# EAGLE design emonDCduo-ESP v3.6 (EAGLE 9.3.0)
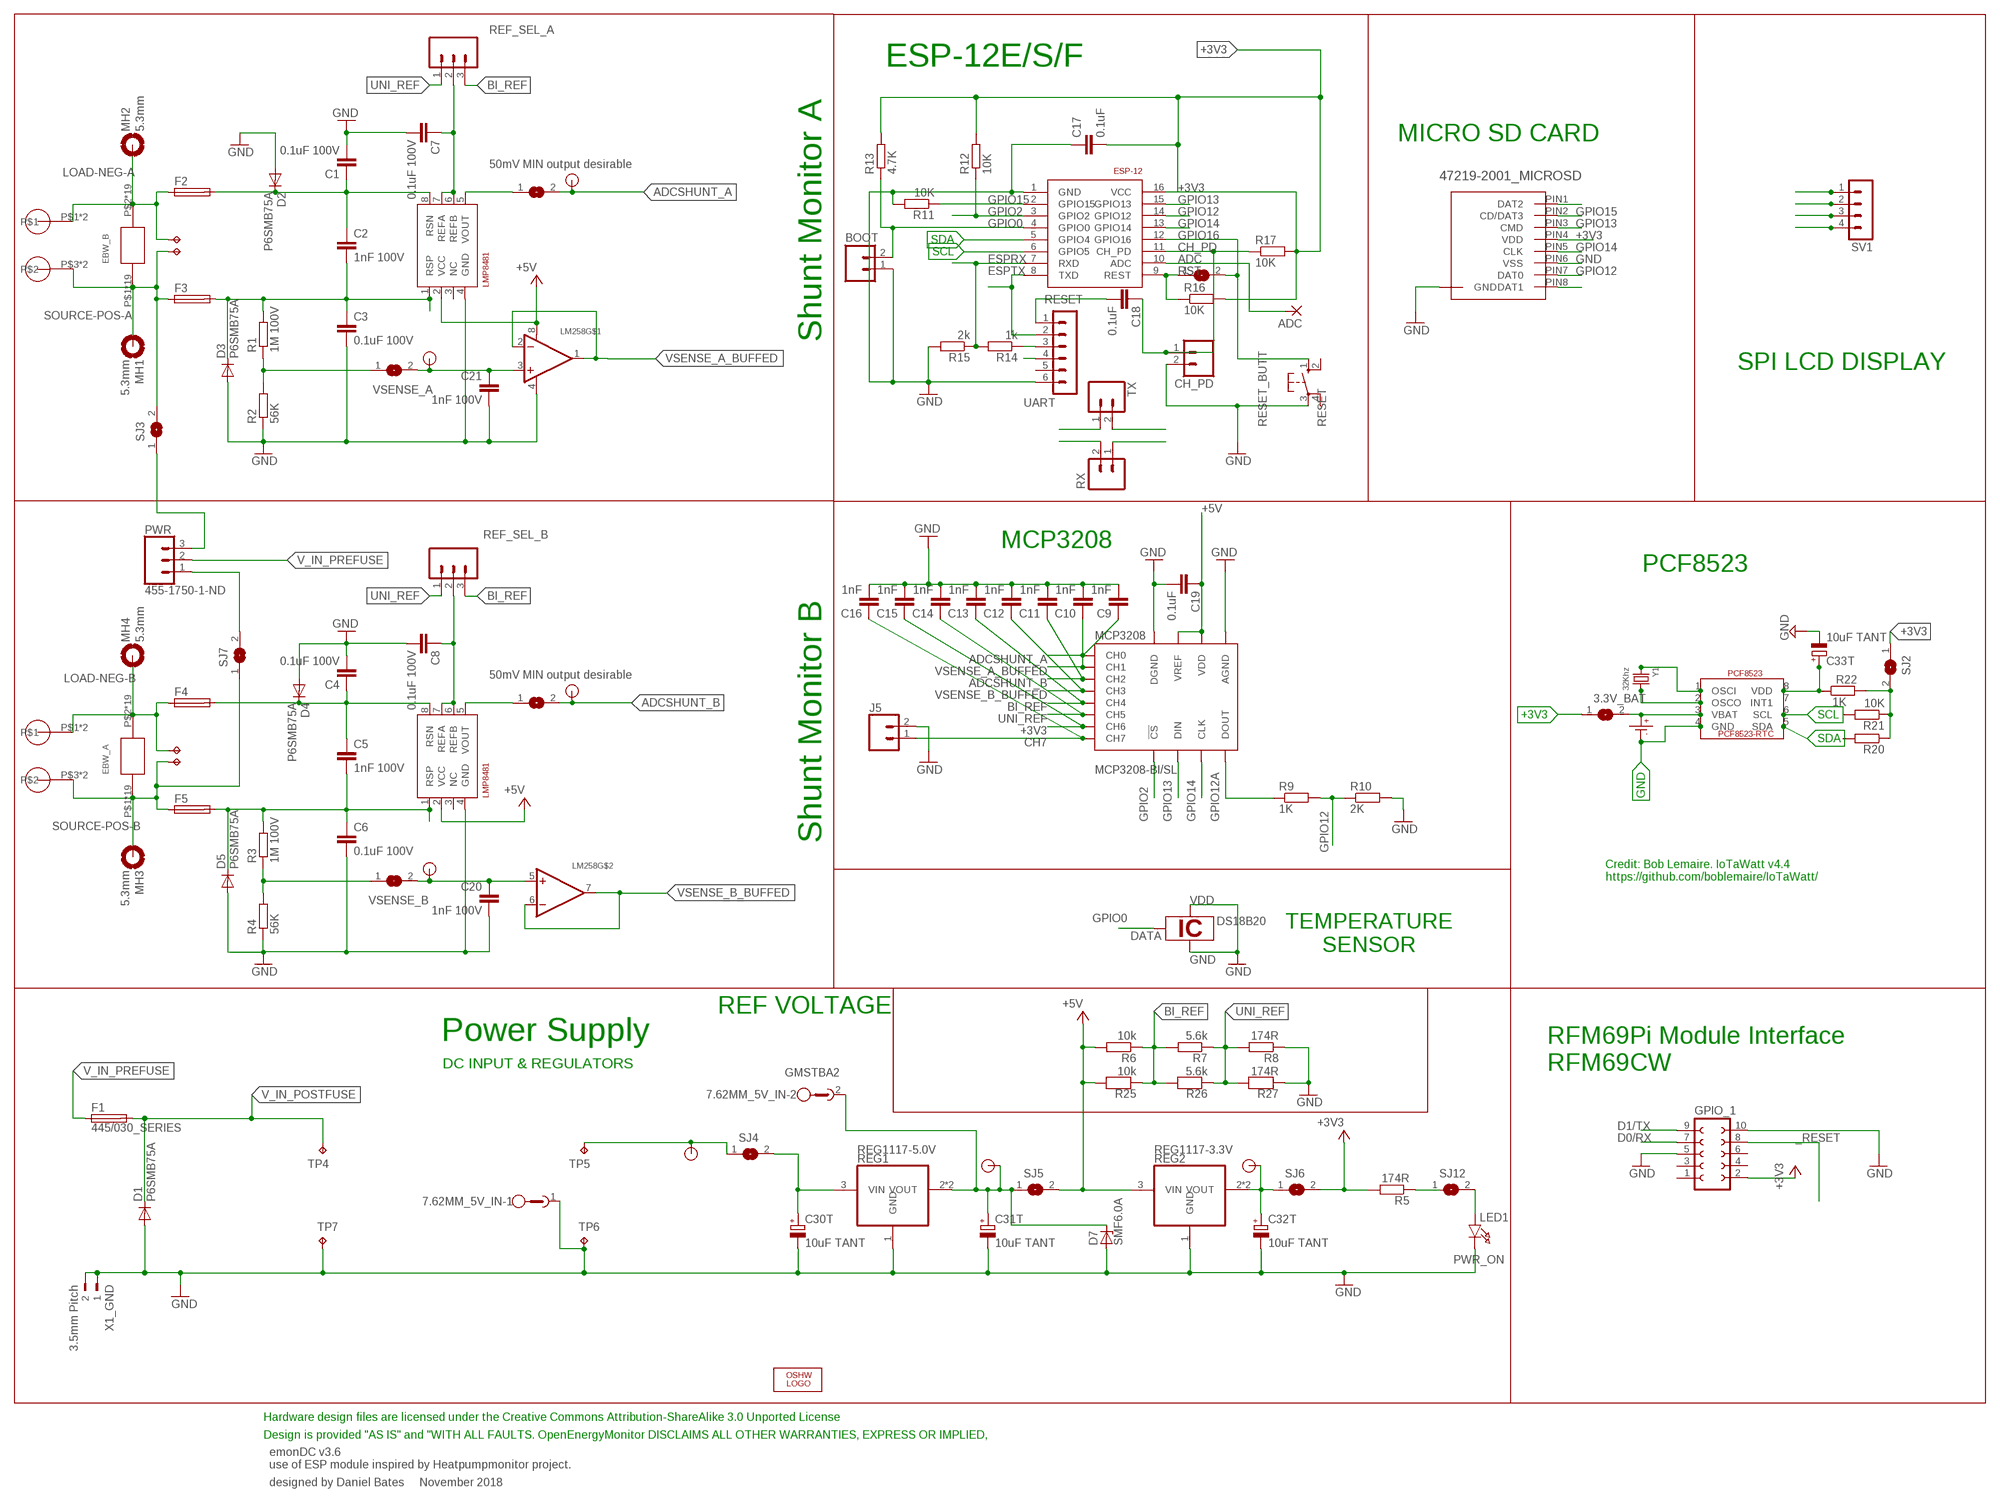
[diagram p0: schematic, sheet 1]

## Parts
3.3V_BAT  SOLDERJUMPERCLOSED  [SOLDERJUMPER_CLOSEDWIRE]
7.62MM_5V_IN  GMSTBA2  [GMSTBA2]
ADC  2,15/1,0  [2,15/1,0]
BOOT  M02PTH  [1X02]
C1  0.1uF 100V  C-EUC0603  [C0603]
C2  1nF 100V  C-EUC0603  [C0603]
C3  0.1uF 100V  C-EUC0603  [C0603]
C4  0.1uF 100V  C-EUC0603  [C0603]
C5  1nF 100V  C-EUC0603  [C0603]
C6  0.1uF 100V  C-EUC0603  [C0603]
C7  0.1uF 100V  C-EUC0603  [C0603]
C8  0.1uF 100V  C-EUC0603  [C0603]
C9  1nF  C-EUC0603  [C0603]
C10  1nF  C-EUC0603  [C0603]
C11  1nF  C-EUC0603  [C0603]
C12  1nF  C-EUC0603  [C0603]
C13  1nF  C-EUC0603  [C0603]
C14  1nF  C-EUC0603  [C0603]
C15  1nF  C-EUC0603  [C0603]
C16  1nF  C-EUC0603  [C0603]
C17  0.1uF  C-EUC0603  [C0603]
C18  0.1uF  C-EUC0603  [C0603]
C19  0.1uF  C-EUC0603  [C0603]
C20  1nF 100V  C-EUC0603  [C0603]
C21  1nF 100V  C-EUC0603  [C0603]
C30T  10uF TANT  CPOL-EUC0603POL  [C0603POL]
C31T  10uF TANT  CPOL-EUC0603POL  [C0603POL]
C32T  10uF TANT  CPOL-EUC0603POL  [C0603POL]
C33T  10uF TANT  CPOL-EUC0603POL  [C0603POL]
CH_PD  M02PTH  [1X02]
CR1220  CR1220SMD  [CR1220SMD]
D1  P6SMB75A  DIODE-DO214AA  [DO214AA]
D2  P6SMB75A  DIODE-DO214AA  [DO214AA]
D3  P6SMB75A  DIODE-DO214AA  [DO214AA]
D4  P6SMB75A  DIODE-DO214AA  [DO214AA]
D5  P6SMB75A  DIODE-DO214AA  [DO214AA]
D7  SMF6.0A  [SOD123F]
EBW_A  EBW_SERIES_15.2MM  [EBW_SERIES_15.2MM]
EBW_B  EBW_SERIES_15.2MM  [EBW_SERIES_15.2MM]
ESP-12  ESP8266_ESP-12  [ESP8266-ESP12]
F1  445/030_SERIES  [445/030_SERIES_LITTELFUSE]
F2  TR5  [TR5]
F3  TR5  [TR5]
F4  TR5  [TR5]
F5  TR5  [TR5]
GPIO_1  FE05-2_RFM69PI_OUTLINERFM69PI  [FE05-2_RFM69PI_OULTINE]
IC1  DS18B20  [TO92-]
J5  CONN_02  [1X02]
LED1  PWR_ON  LED1206  [CHIPLED_1206]
LM258  LM358  [SOIC8_150MIL]
LOGO1  OSHW_LOGO_6MILX0200-NT  [OSHW_6X200_NOTEXT]
MCP3208  MCP3208-BI/SL  [SOIC16]
MH1  5.3mm  MOUNT-PAD-ROUND5.3  [5,3//11-PAD]
MH2  5.3mm  MOUNT-PAD-ROUND5.3  [5,3//11-PAD]
MH3  5.3mm  MOUNT-PAD-ROUND5.3  [5,3//11-PAD]
MH4  5.3mm  MOUNT-PAD-ROUND5.3  [5,3//11-PAD]
MICRO_SD  47219-2001_MICROSD  [47219-2001_MICROSD]
MOUNT_10.16_A  MOLEX_39970-003  [2/10,16]
MOUNT_10.16_B  MOLEX_39970-003  [2/10,16]
PCF8523  PCF8523_RTC  [SOIC_8]
PWR  455-1750-1-ND  CONN_03  [1X03]
R1  1M 100V  R-EU_0207/2V  [0207/2V]
R2  56K  R-EU_0207/2V  [0207/2V]
R3  1M 100V  R-EU_0207/2V  [0207/2V]
R4  56K  R-EU_0207/2V  [0207/2V]
R5  174R  R-EU_R0603  [R0603]
R6  10k  R-EU_0207/10  [0207/10]
R7  5.6k  R-EU_0207/10  [0207/10]
R8  174R  R-EU_0207/10  [0207/10]
R9  1K  R-EU_R0603  [R0603]
R10  2K  R-EU_R0603  [R0603]
R11  10K  R-EU_R0603  [R0603]
R12  10K  R-EU_R0603  [R0603]
R13  4.7K  R-EU_R0603  [R0603]
R14  1k  R-EU_R0603  [R0603]
R15  2k  R-EU_R0603  [R0603]
R16  10K  R-EU_R0603  [R0603]
R17  10K  R-EU_R0603  [R0603]
R20  10K  R-EU_R0603  [R0603]
R21  10K  R-EU_R0603  [R0603]
R22  1K  R-EU_R0603  [R0603]
R25  10k  RESISTOR0603  [0603]
R26  5.6k  RESISTOR0603  [0603]
R27  174R  RESISTOR0603  [0603]
REF_SEL_A  455-1750-1-ND  CONN_03  [1X03]
REF_SEL_B  455-1750-1-ND  CONN_03  [1X03]
REG1  REG1117-5.0V  REG1117  [SOT223]
REG2  REG1117-3.3V  REG1117  [SOT223]
RESET  RESET_BUTT  10-XX  [B3F-10XX]
RX  M02PTH  [1X02]
SHUNTMON-A  LMP8481  LMP8481-H  [S-PDSO-G08]
SHUNTMON-B  LMP8481  LMP8481-H  [S-PDSO-G08]
SJ1  SOLDERJUMPERCLOSED  [SOLDERJUMPER_CLOSEDWIRE]
SJ2  SOLDERJUMPERCLOSED  [SOLDERJUMPER_CLOSEDWIRE]
SJ3  SJ  [SJ]
SJ4  SOLDERJUMPERCLOSED  [SOLDERJUMPER_CLOSEDWIRE]
SJ5  SOLDERJUMPERCLOSED  [SOLDERJUMPER_CLOSEDWIRE]
SJ6  SOLDERJUMPERCLOSED  [SOLDERJUMPER_CLOSEDWIRE]
SJ7  SJ  [SJ]
SJ8  SOLDERJUMPERCLOSED  [SOLDERJUMPER_CLOSEDWIRE]
SJ9  SOLDERJUMPERCLOSED  [SOLDERJUMPER_CLOSEDWIRE]
SJ10  SOLDERJUMPERCLOSED  [SOLDERJUMPER_CLOSEDWIRE]
SJ11  SOLDERJUMPERCLOSED  [SOLDERJUMPER_CLOSEDWIRE]
SJ12  SJ  [SJ]
SV1  MA04-1  [MA04-1]
TP4  TPPAD1-13Y  [P1-13Y]
TP5  TPPAD1-13Y  [P1-13Y]
TP6  TPPAD1-13Y  [P1-13Y]
TP7  TPPAD1-13Y  [P1-13Y]
TP8  TPPAD1-13Y  [P1-13Y]
TP9  TPPAD1-13Y  [P1-13Y]
TP10  TPPAD1-13Y  [P1-13Y]
TP11  TPPAD1-13Y  [P1-13Y]
TX  M02PTH  [1X02]
U$1  TP0.8MM  [TP0.8]
U$4  TP0.8MM  [TP0.8]
U$5  TP0.8MM  [TP0.8]
U$6  TP0.8MM  [TP0.8]
U$7  TP0.8MM  [TP0.8]
U$8  TP0.8MM  [TP0.8]
U$9  TP0.8MM  [TP0.8]
UART  UART  MA06-1  [MA06-1]
X1_GND  3.5mm Pitch  180-2  [180-2]
Y1  32Khz  CRYSTAL8X3.8SMT  [CRYSTAL_8X3.8]

## Nets
3.3V_PRE [thin_power]: C32T.1(+) REG2.2(VOUT) REG2.4(VOUT) SJ6.1 U$8.P$1
5V_PRE [thin_power]: 7.62MM_5V_IN.2 C31T.1(+) D7.C REG1.2(VOUT) REG1.4(VOUT) SJ5.1 U$7.P$1
6.5V [thin_power]: C30T.1(+) REG1.3(VIN) SJ4.2
+3V3 [thin_power2]: 3.3V_BAT.1 C15.1 C17.2 ESP-12.16(VCC) GPIO_1.2 MCP3208.7(CH6) MICRO_SD.PIN4(VDD) R5.2 R12.2 R13.2 R16.2 R17.2 SJ2.1 SJ6.2 SV1.3
+5V [thin_power2]: C19.1 LM258.8(V+) MCP3208.15(VREF) MCP3208.16(VDD) R6.2 R25.2 REG2.3(VIN) SHUNTMON-A.2(VCC) SHUNTMON-B.2(VCC) SJ5.2 UART.4
_RESET: GPIO_1.8
ADC: ADC.1(P) ESP-12.10(ADC)
ADCSHUNT_A: C9.1 MCP3208.1(CH0) SJ11.2 U$6.P$1
ADCSHUNT_B: C11.1 MCP3208.3(CH2) SJ10.2 U$5.P$1
BI_REF: C13.1 MCP3208.5(CH4) R6.1 R7.2 R25.1 R26.2 REF_SEL_A.3 REF_SEL_B.3
CH7: C16.1 J5.1 MCP3208.8(CH7)
CH_PD: C18.1 CH_PD.1 ESP-12.11(CH_PD) R17.1
D0/RX: GPIO_1.7 TX.2
D1/TX: GPIO_1.9 RX.1
ESPRX: ESP-12.7(RXD) R14.2 R15.1 RX.2
ESPTX: ESP-12.8(TXD) TX.1 UART.2
GND: 7.62MM_5V_IN.1 BOOT.1 C1.2 C3.2 C4.2 C6.2 C7.2 C8.2 C9.2 C10.2 C11.2 C12.2 C13.2 C14.2 C15.2 C16.2 C17.1 C19.2 C20.2 C21.2 C30T.2(-) C31T.2(-) C32T.2(-) C33T.2(-) CH_PD.2 CR1220.P-(P$-) D1.A D2.A D3.A D4.A D5.A D7.A ESP-12.1(GND) GPIO_1.5 GPIO_1.10 IC1.1(GND) IC1.3(VDD) J5.2 LED1.C LM258.4(V-) MCP3208.9(DGND) MCP3208.14(AGND) MICRO_SD.P$1(GND) MICRO_SD.P$2(GND) MICRO_SD.P$3(GND) MICRO_SD.P$4(GND) MICRO_SD.PIN6(VSS) PCF8523.4(GND) R2.1 R4.1 R8.1 R10.2 R11.2 R15.2 R27.1 REG1.1(GND) REG2.1(GND) RESET.3(P) SHUNTMON-A.4(GND) SHUNTMON-B.4(GND) SV1.4 TP6.TP TP7.TP UART.6 X1_GND.1 X1_GND.2
GPIO0: BOOT.2 ESP-12.4(GPIO0) IC1.2(DATA) R13.1
GPIO2: ESP-12.3(GPIO2) MCP3208.10(!CS) R12.1
GPIO12: ESP-12.14(GPIO12) MICRO_SD.PIN7(DAT0) R9.2 R10.1
GPIO12A: MCP3208.12(DOUT) R9.1
GPIO13: ESP-12.15(GPIO13) MCP3208.11(DIN) MICRO_SD.PIN3(CMD)
GPIO14: ESP-12.13(GPIO14) MCP3208.13(CLK) MICRO_SD.PIN5(CLK)
GPIO15: ESP-12.2(GPIO15) MICRO_SD.PIN2(CD/DAT3) R11.1
GPIO16: ESP-12.12(GPIO16) RESET.1(S) SJ1.2
LOAD-NEG-A [power]: EBW_B.P$2 EBW_B.P$18 EBW_B.P$19 EBW_B.P$20 EBW_B.P$21 EBW_B.P$22 EBW_B.P$23 EBW_B.P$24 EBW_B.P$25 EBW_B.P$26 EBW_B.P$27 EBW_B.P$28 EBW_B.P$29 EBW_B.P$30 EBW_B.P$31 EBW_B.P$32 EBW_B.P$36 EBW_B.P$37 EBW_B.P$38 F2.1 MH2.B5,5(MOUNT) MOUNT_10.16_A.P$1 MOUNT_10.16_A.P$2 TP11.TP
LOAD-NEG-A_T [thin_power]: C1.1 C2.1 D2.C F2.2 SHUNTMON-A.8(RSN)
LOAD-NEG-B [power]: EBW_A.P$2 EBW_A.P$18 EBW_A.P$19 EBW_A.P$20 EBW_A.P$21 EBW_A.P$22 EBW_A.P$23 EBW_A.P$24 EBW_A.P$25 EBW_A.P$26 EBW_A.P$27 EBW_A.P$28 EBW_A.P$29 EBW_A.P$30 EBW_A.P$31 EBW_A.P$32 EBW_A.P$36 EBW_A.P$37 EBW_A.P$38 F4.1 MH4.B5,5(MOUNT) MOUNT_10.16_B.P$1 MOUNT_10.16_B.P$2 TP9.TP
LOAD-NEG-B_T [thin_power]: C4.1 C5.1 D4.C F4.2 SHUNTMON-B.8(RSN)
N$1: SJ4.1 TP5.TP U$9.P$1
N$3 [power]: PWR.3 SJ3.1
N$4 [power]: PWR.1 SJ7.2
N$5: R5.1 SJ12.1
N$6: LED1.A SJ12.2
N$7: MICRO_SD.PIN1(DAT2)
N$10: SHUNTMON-B.5(VOUT) SJ10.1
N$11: SHUNTMON-A.5(VOUT) SJ11.1
N$32: MICRO_SD.PIN8(DAT1)
N$36: R14.1 UART.3
N$44: PCF8523.2(OSCO) Y1.P$4
N$45: PCF8523.1(OSCI) Y1.P$1
REF_A_INPUT: C7.1 REF_SEL_A.2 SHUNTMON-A.6(REFB) SHUNTMON-A.7(REFA)
REF_B_INPUT: C8.1 REF_SEL_B.2 SHUNTMON-B.6(REFB) SHUNTMON-B.7(REFA)
RESET: C18.2 UART.1
RST: ESP-12.9(REST) R16.1 SJ1.1
SCL: ESP-12.6(GPIO5) PCF8523.6(SCL) SV1.2
SDA: ESP-12.5(GPIO4) PCF8523.5(SDA) SV1.1
SOURCE-POS-A [power]: EBW_B.P$1 EBW_B.P$3 EBW_B.P$4 EBW_B.P$5 EBW_B.P$6 EBW_B.P$7 EBW_B.P$8 EBW_B.P$9 EBW_B.P$10 EBW_B.P$11 EBW_B.P$12 EBW_B.P$13 EBW_B.P$14 EBW_B.P$15 EBW_B.P$16 EBW_B.P$17 EBW_B.P$33 EBW_B.P$34 EBW_B.P$35 F3.1 MH1.B5,5(MOUNT) MOUNT_10.16_A.P$3 MOUNT_10.16_A.P$4 SJ3.2 TP10.TP
SOURCE-POS-A_T [thin_power]: C2.2 C3.1 D3.C F3.2 R1.2 SHUNTMON-A.1(RSP)
SOURCE-POS-B [power]: EBW_A.P$1 EBW_A.P$3 EBW_A.P$4 EBW_A.P$5 EBW_A.P$6 EBW_A.P$7 EBW_A.P$8 EBW_A.P$9 EBW_A.P$10 EBW_A.P$11 EBW_A.P$12 EBW_A.P$13 EBW_A.P$14 EBW_A.P$15 EBW_A.P$16 EBW_A.P$17 EBW_A.P$33 EBW_A.P$34 EBW_A.P$35 F5.1 MH3.B5,5(MOUNT) MOUNT_10.16_B.P$3 MOUNT_10.16_B.P$4 SJ7.1 TP8.TP
SOURCE-POS-B_T [thin_power]: C5.2 C6.1 D5.C F5.2 R3.2 SHUNTMON-B.1(RSP)
UNI_REF: C14.1 MCP3208.6(CH5) R7.1 R8.2 R26.1 R27.2 REF_SEL_A.1 REF_SEL_B.1
V_IN_POSTFUSE [power]: D1.C F1.P$3 F1.P$4 TP4.TP
V_IN_PREFUSE [power]: F1.P$1 F1.P$2 PWR.2
VBAT: 3.3V_BAT.2 CR1220.P+(P$+) PCF8523.3(VBAT)
VDD_PCF: C33T.1(+) PCF8523.8(VDD) R22.1
VDD_RTC_POSTJUMPER: R20.1 R21.1 R22.2 SJ2.2
VSENSE_A: R1.1 R2.2 SJ8.1
VSENSE_A_BUFFED: C10.1 LM258.1(OUT) LM258.2(-IN) MCP3208.2(CH1)
VSENSE_A_TP: C21.1 LM258.3(+IN) SJ8.2 U$1.P$1
VSENSE_B: R3.1 R4.2 SJ9.1
VSENSE_B_BUFFED: C12.1 LM258.6(-IN) LM258.7(OUT) MCP3208.4(CH3)
VSENSE_B_TP: C20.1 LM258.5(+IN) SJ9.2 U$4.P$1
Unconnected: GPIO_1.1 GPIO_1.3 GPIO_1.4 GPIO_1.6 PCF8523.7(INT1) R20.2 R21.2 RESET.2(S1) RESET.4(P1) SHUNTMON-A.3(NC) SHUNTMON-B.3(NC) UART.5

## Notes on the sheet
- ESP-12E/S/F
- MICRO SD CARD
- 50mV MIN output desirable
- Shunt Monitor A
- SPI LCD DISPLAY
- MCP3208
- PCF8523
- 50mV MIN output desirable
- Shunt Monitor B
- Credit: Bob Lemaire. IoTaWatt v4.4
  https://github.com/boblemaire/IoTaWatt/
- TEMPERATURE
  SENSOR
- REF VOLTAGE
- Power Supply
- DC INPUT & REGULATORS
- RFM69Pi Module Interface
  RFM69CW
- Hardware design files are licensed under the Creative Commons Attribution-ShareAlike 3.0 Unported License
- Design is provided "AS IS" and "WITH ALL FAULTS. OpenEnergyMonitor DISCLAIMS ALL OTHER WARRANTIES, EXPRESS OR IMPLIED,
- emonDC v3.6
  use of ESP module inspired by Heatpumpmonitor project.
- designed by Daniel Bates     November 2018

## Library data of the parts
3.3V_BAT SJ1 SJ2 SJ4-SJ6 SJ8-SJ11 = microbuilder:SOLDERJUMPER: SMD Solder JUMPER Solder the two pads together to create a connection, or remove the solder to break it. REFLOW - Use this footprint for solder paste and reflow ovens. WAVE - Use this footprint for hand-soldering (larger pads). CLOSED - Has a trace between the two pads to ensure it is closed by default. The trace needs to be cut to disable the jumper, and can be closed again by creating a solder bridge between the two pads.
7.62MM_5V_IN = con-phoenix-762:GMSTBA2: PHOENIX; MF: FARNELL; MPN: 1757242; OC_FARNELL: 3705171; OC_NEWARK: 71C4161
ADC = wirepad:2,15/1,0: THROUGH-HOLE PAD
BOOT CH_PD RX TX = SparkFun:M02: Header 2 Standard 2-pin 0.1" header. Use with straight break away headers (SKU : PRT-00116), right angle break away headers (PRT-00553), swiss pins (PRT-00743), machine pins (PRT-00117), and female headers (PRT-00115). Molex polarized connector foot print use with SKU : PRT-08233 with associated crimp pins and housings.
C1-C8 C20 C21 = rcl:C-EU: CAPACITOR, European symbol; MPN: C1608X7S2A104K080AB
C9-C19 = rcl:C-EU: CAPACITOR, European symbol
C30T C31T C32T C33T = rcl7:CPOL-EU: POLARIZED CAPACITOR, European symbol
CR1220 = IotaWatt_parts:CR1220SMD: CR1220 Battery SMD; MPN: Harwin S8411-45R
D1-D5 = diode:DIODE-: DIODE
D7 = smf_10:SMF*A: SMF Series TVS Diodes Source: http://www.littelfuse.com/~/media/electronics/datasheets/tvs_diodes/littelfuse_tvs_diode_smf_datasheet.pdf.pdf; MF: Littelfuse; MPN: SMF6.0A; OC_FARNELL: unknown; OC_NEWARK: unknown
EBW_A EBW_B = EBW series SHUNT:EBW_SERIES_15.2MM
ESP-12 = ESP8266-ESP12:ESP8266_ESP-12
F1 = LITTELFUSE 455:030 SERIES:445/030_SERIES: MPN 04450001N
F2-F5 = fuse:TR5: FUSE Wickmann; OC_FARNELL: unknown; OC_NEWARK: unknown
GPIO_1 = con-lsta-RFM69Pi:FE05-2_RFM69PI_OUTLINE: FEMALE HEADER
IC1 = DS18B20:DS18B20: Programmable Resolution Digital Thermometer This chip provides a onewire thermosensor with approx. 0.5°C accuracy. A programmable over/undertemperure alarm is available. The precision can be set from 9..12 bits. Notes: Vdd must be applied for accurate measurements at low temperatures, as the parasite power circuit otherwise heats the sensor. If parasite power is used, Vdd has to be connected to GND. The DS1822 is a low-cost thermometer chip, the DS18S20 is similar to the DS18B20, but with 9 Bit precision only. Author: Jan Kandziora <jjj@gmx.de>
J5 = SparkFun-Connectors:CONN_02: Multi connection point. Often used as Generic Header-pin footprint for 0.1 inch spaced/style header connections On any of the 0.1 inch spaced packages, you can populate with these: Break Away Headers - Straight <https://www.sparkfun.com/products/116> (PRT-00116) Break Away Male Headers - Right Angle <https://www.sparkfun.com/products/553> (PRT-00553) Female Headers <https://www.sparkfun.com/products/115> (PRT-00115) Break Away Headers - Machine Pin <https://www.sparkfun.com/products/117> (PRT-00117) Break Away Female Headers - Swiss Machine Pin <https://www.sparkfun.com/products/743> (PRT-00743) For SCREWTERMINALS and SPRING TERMINALS visit here: Screw Terimnals on SparkFun.com <https://www.sparkfun.com/search/results?term=Screw+Terminals> (5mm/3.5mm/2.54mm spacing) This device is also useful as a general connection point to wire up your design to another part of your project. Our various solder wires solder well into these plated through hole pads. Hook-Up Wire - Assortment (Stranded, 22 AWG) <https://www.sparkfun.com/products/11375> (PRT-11375) Hook-Up Wire - Assortment (Solid Core, 22 AWG) <https://www.sparkfun.com/products/11367> (PRT-11367) View the entire wire category on our website here <https://www.sparkfun.com/categories/141> Special notes: Molex polarized connector foot print use with: PRT-08233 with associated crimp pins and housings. 2.54_SCREWTERM for use with PRT-10571. 3.5mm Screw Terminal footprints for PRT-08084 5mm Screw Terminal footprints for use with PRT-08432
LED1 = microbuilder:LED: LED 0603 - 0603 Surface Mount Package 2mA: Green LED - Low Power (3.9mcd, 2ma, 1.7Vf) - Digikey: 475-2709-2-ND Orange LED - Low Power (9.8mcd, 2ma, 1.8Vf) - Digikey: 475-1194-2-ND Red LED - Low Power (5mcd, 2ma, 1.8Vf) - Digikey: 475-1195-2-ND Yellow LED - Low Power (7mcd, 2ma, 1.8Vf) - Digikey: 475-1196-2-ND 5mA: Blue LED - Low Power (17mcd, 5ma, 2.9Vf) - Digikey: LNJ937W8CRACT-ND 0805 - 0805 Surface Mount Package 2mA: Red LED (8.8mcd, 2mA, 1.8Vf, Clear) - Low Power [Digikey: 475-2510-1-ND] Green LED (5mcd, 2mA, 1.8Vf, Clear) - Low Power [Digikey: 475-2730-1-ND] Yellow LED (11.3mcd, 2mA, 1.8Vf, Clear) - Low Power [Digikey: 475-2555-1-ND] 20mA: Red LED (104mcd, 20mA, Diffused) - LS R976 [Digikey: 475-1278-6-ND] Red LED (12mcd, 20mA, 2.0Vf, Clear) - APT2012EC [Digikey: 754-1128-1-ND] Green LED (15mcd, 20mA, 2.2Vf, Clear) - APT2012GC [Digikey: 754-1131-1-ND] Orange LED (160mcd, 20mA, 2.1Vf, Clear) - APT2012SECK [Digikey: 754-1130-1-ND] 1206 - 1206 Surface Mount Package Green LED (26mcd, 20mA, Diffused) - LG N971 [Digikey: 475-1407-6-ND] Red LED (15mcd, 20mA, Diffused) - LH N974 [Digikey: 475-1416-6-ND]
LM258 = microbuilder:LM358: LM358 Dual Operational Amplifier Digikey: LM358AMXFSCT-ND
LOGO1 = ohw-logo:OSHW_LOGO_6MIL; OC_FARNELL: unknown
MCP3208 = MCP3208:MCP3208
MH1-MH4 = holes-db:MOUNT-PAD-ROUND: MOUNTING PAD, round
MICRO_SD = MOLEX 47219-2001:47219-2001_MICROSD
MOUNT_10.16_A MOUNT_10.16_B = 10.16mm terminal block:MOLEX_39970-003
PCF8523 = emonDC parts:PCF8523_RTC: PCF8523-RTC SOIC-8
PWR = SparkFun-Connectors:CONN_03: Multi connection point. Often used as Generic Header-pin footprint for 0.1 inch spaced/style header connections On any of the 0.1 inch spaced packages, you can populate with these: Break Away Headers - Straight <https://www.sparkfun.com/products/116> (PRT-00116) Break Away Male Headers - Right Angle <https://www.sparkfun.com/products/553> (PRT-00553) Female Headers <https://www.sparkfun.com/products/115> (PRT-00115) Break Away Headers - Machine Pin <https://www.sparkfun.com/products/117> (PRT-00117) Break Away Female Headers - Swiss Machine Pin <https://www.sparkfun.com/products/743> (PRT-00743) Stackable Header - 3 Pin (Female, 0.1") <https://www.sparkfun.com/products/13875> (PRT-13875) For SCREWTERMINALS and SPRING TERMINALS visit here: Screw Terimnals on SparkFun.com <https://www.sparkfun.com/search/results?term=Screw+Terminals> (5mm/3.5mm/2.54mm spacing) This device is also useful as a general connection point to wire up your design to another part of your project. Our various solder wires solder well into these plated through hole pads. Hook-Up Wire - Assortment (Stranded, 22 AWG) <https://www.sparkfun.com/products/11375> (PRT-11375) Hook-Up Wire - Assortment (Solid Core, 22 AWG) <https://www.sparkfun.com/products/11367> (PRT-11367) View the entire wire category on our website here <https://www.sparkfun.com/categories/141> Special notes: Molex polarized connector foot print use with SKU : PRT-08232 with associated crimp pins and housings.; PROD_ID: XXX-00000
R1 R3 = rcl7:R-EU_: RESISTOR, European symbol; MPN: MCWR06X1003FTL
R2 R4 = rcl7:R-EU_: RESISTOR, European symbol; MPN: MCWR06X5901FTL
R5 = rcl:R-EU_: RESISTOR, European symbol; SPICEPREFIX: R
R6-R8 = rcl7:R-EU_: RESISTOR, European symbol
R9 R10 = rcl:R-EU_: RESISTOR, European symbol; MPN: MCWR06X5901FTL
R11-R17 R20 R21 = rcl:R-EU_: RESISTOR, European symbol
R22 = rcl@1:R-EU_: RESISTOR, European symbol
R25-R27 = microbuilder:RESISTOR: Resistors 0402 - 0402 Surface Mount Package 22 Ohm 1% 1/16W [Digikey: 311-22.0LRTR-ND] 33 Ohm 5% 1/16W 1.0K 5% 1/16W 1.5K 5% 1/16W 2.0K 1% 1/16W 10.0K 1% 1/16W [Digikey: 311-10.0KLRTR-ND] 10.0K 5% 1/16W [Digikey: RMCF0402JT10K0TR-ND] 12.1K 1% 1/16W [Digikey: 311-22.0LRTR-ND] 100.0K 5% 1/16W 0603 - 0603 Surface Mount Package 0 Ohm 1/10 Watt 1% Resistor 15 Ohm 1/10 Watt 1% Resistor 33 Ohm 1/10 Watt 1% Resistor 49.9 Ohm 1/10 Watt 1% Resistor 100 Ohm 1/10 Watt 1% Resistor 150 Ohm 1/10 Watt 1% Resistor 240 Ohm 1/10 Watt 1% Resistor 390 Ohm 1/10 Watt 1% Resistor 560 Ohm 1/10 Watt 1% Resistor 680 Ohm 1/10 Watt 1% Resistor 750 Ohm 1/10 Watt 1% Resistor 1.0K Ohm 1/10 Watt 1% Resistor 1.5K Ohm 1/10 Watt 1% Resistor 2.0K Ohm 1/10 Watt 1% Resistor 2.2K Ohm 1/10 Watt 1% Resistor 3.3K Ohm 1/10 Watt 1% Resistor 4.7K Ohm 1/10 Watt 1% Resistor 10.0K Ohm 1/10 Watt 1% Resistor 12.0K Ohm 1/10 Watt 1% Resistor 12.1K Ohm 1/10 Watt 1% Resistor 20.0K Ohm 1/10 Watt 1% Resistor 33.0K Ohm 1/10 Watt 1% Resistor 100.0K Ohm 1/10 Watt 1% Resistor 0805 - 0805 Surface Mount Package 0 Ohm 1/8 Watt 1% Resistor 33 Ohm 1/8 Watt 1% Resistor 100 Ohm 1/8 Watt 1% Resistor 150 Ohm 1/8 Watt 1% Resistor 200 Ohm 1/8 Watt 1% Resistor 240 Ohm 1/8 Watt 1% Resistor 330 Ohm 1/8 Watt 1% Resistor 390 Ohm 1/8 Watt 1% Resistor 470 Ohm 1/8 Watt 1% Resistor 1.0K Ohm 1/8 Watt 1% Resistor 1.5K Ohm 1/8 Watt 1% Resistor 2.0K Ohm 1/8 Watt 1% Resistor 4.7K Ohm 1/8 Watt 1% Resistor 5.1K Ohm 1/8 Watt 1% Resistor 5.6K Ohm 1/8 Watt 1% Resistor 10.0K Ohm 1/8 Watt 1% Resistor 22.0K Ohm 1/8 Watt 1% Resistor 33.0K Ohm 1/8 Watt 1% Resistor 100K Ohm 1/8 Watt 1% Resistor 1206 - 1206 Surface Mount Package 2012 - 2010 Surface Mount Package 0.11 Ohm 1/2 Watt 1% Resistor - Digikey: RHM.11UCT-ND
REF_SEL_A REF_SEL_B = SparkFun-Connectors:CONN_03: Multi connection point. Often used as Generic Header-pin footprint for 0.1 inch spaced/style header connections On any of the 0.1 inch spaced packages, you can populate with these: Break Away Headers - Straight <https://www.sparkfun.com/products/116> (PRT-00116) Break Away Male Headers - Right Angle <https://www.sparkfun.com/products/553> (PRT-00553) Female Headers <https://www.sparkfun.com/products/115> (PRT-00115) Break Away Headers - Machine Pin <https://www.sparkfun.com/products/117> (PRT-00117) Break Away Female Headers - Swiss Machine Pin <https://www.sparkfun.com/products/743> (PRT-00743) Stackable Header - 3 Pin (Female, 0.1") <https://www.sparkfun.com/products/13875> (PRT-13875) For SCREWTERMINALS and SPRING TERMINALS visit here: Screw Terimnals on SparkFun.com <https://www.sparkfun.com/search/results?term=Screw+Terminals> (5mm/3.5mm/2.54mm spacing) This device is also useful as a general connection point to wire up your design to another part of your project. Our various solder wires solder well into these plated through hole pads. Hook-Up Wire - Assortment (Stranded, 22 AWG) <https://www.sparkfun.com/products/11375> (PRT-11375) Hook-Up Wire - Assortment (Solid Core, 22 AWG) <https://www.sparkfun.com/products/11367> (PRT-11367) View the entire wire category on our website here <https://www.sparkfun.com/categories/141> Special notes: Molex polarized connector foot print use with SKU : PRT-08232 with associated crimp pins and housings.; MF: MULTICOMP; MPN: 2212S-02SG-85; OC_FARNELL: 1593458; PROD_ID: XXX-00000
REG1 = burr-brown-db:REG1117: 800mA and 1A Low Dropout (LDO) Positive Regulator 1.8V, 2.5V, 2.85V, 3.3V, 5V, and Adj; MF: TEXAS INSTRUMENTS; MPN: REG1117-5.0; OC_FARNELL: 1097566; OC_NEWARK: 14P6981
REG2 = burr-brown-db:REG1117: 800mA and 1A Low Dropout (LDO) Positive Regulator 1.8V, 2.5V, 2.85V, 3.3V, 5V, and Adj; MF: TEXAS INSTRUMENTS; MPN: REG1117-3.3; OC_FARNELL: 1097566; OC_NEWARK: 14P6981
RESET = switch-omron:10-XX: OMRON SWITCH; MPN: B3F-1000; OC_FARNELL: 176432; OC_NEWARK: 36M3542
SHUNTMON-A = lmp8481b:LMP8481: LMP8481MM-H/NOPB 100V/V; MF: TEXAS INSTRUMENTS; MPN: LMP8481MME-S/NOPB; OC_FARNELL: 2322044
SHUNTMON-B = lmp8481b:LMP8481: LMP8481MM-H/NOPB 100V/V; MF: TEXAS INSTRUMENTS; MPN: LMP8481MME-H/NOPB; OC_FARNELL: 2322044
SJ3 SJ7 = jumper:SJ: SMD solder JUMPER
SJ12 = jumper-con_db:SJ: SMD solder JUMPER
SV1 = con-lstb:MA04-1: PIN HEADER; OC_FARNELL: unknown; OC_NEWARK: unknown
TP4-TP11 = testpad:TP: Test pad
U$1 U$4-U$9 = testpad_db:TP
UART = JeeLabs:MA06-1: PIN HEADER
X1_GND = con-weidmueller-sl35_db:180-2: WEIDMUELLER CLAMP CONNECTOR; OC_FARNELL: unknown; OC_NEWARK: unknown
Y1 = microbuilder:CRYSTAL: Crystals HC49UP - Surface Mount Crystal 4.0MHz 18pF +/-30ppm Surface Mount Crystal [Digikey: 535-9857-1-ND] 12.0 MHz Surface Mount Crystal [Digikey: 535-9869-6-ND] 25.0 MHz Surface Mount Crystal [Digikey: 535-9078-1-ND] 2.5 x 2.0mm - MEMs SMT Crystal 16.0 MHz 10pF 20ppm 2.5 x 2.0mm Crystal [Digikey -40-85°C: 535-10923-1-ND] 3.2 x 2.5mm - MEMs SMT Crystal 12.0 MHz 8pF 15ppm 3.2 x 2.5mm Crystal [Digikey: -10-70°C: 644-1047-1-ND -40-125°C: 644-1128-1-ND] 16.0 MHz 8pF 15ppm 3.2 x 2.5mm Crystal [Digikey: -10-70°C: 644-1049-1-ND -40-125°C: 644-1129-2-ND] 16.0 MHz 10pF 10ppm 3.2 x 2.5mm Crystal [Digikey: 644-1100-1-ND] 27.12 MHz 18pF 30ppm 3.2 x 2.5mm Crystal [Digikey: 887-1424-1-ND] 27.12MHz 10pF 10ppm 3.2 x 2.5mm Crystal [Digikey: 887-1329-1-ND] 4.9 x 1.8mm - MEMs SMT Crystal 32.768 KHz 12.5pF 20ppm 4.9 x 1.8mm Crystal [Digikey: SE2415CT-ND] 8.0 x 3.8mm - Surface Mount Crystal 32.768kHz 12.5pF 20ppm -40°C-85°C [Digikey: 535-9166-2-ND] Cylinder 32.768KHz Cylinder Crystal (2x6mm body) [Ex. Digikey: 300-8341-2-ND]

## Net classes
0 default: clearance 0.254 mm
1 power: width 0.61 mm, clearance 0.61 mm
2 thin_power: width 0.406 mm, clearance 0.305 mm
3 thin_power2: width 0.254 mm, clearance 0.254 mm

## Board
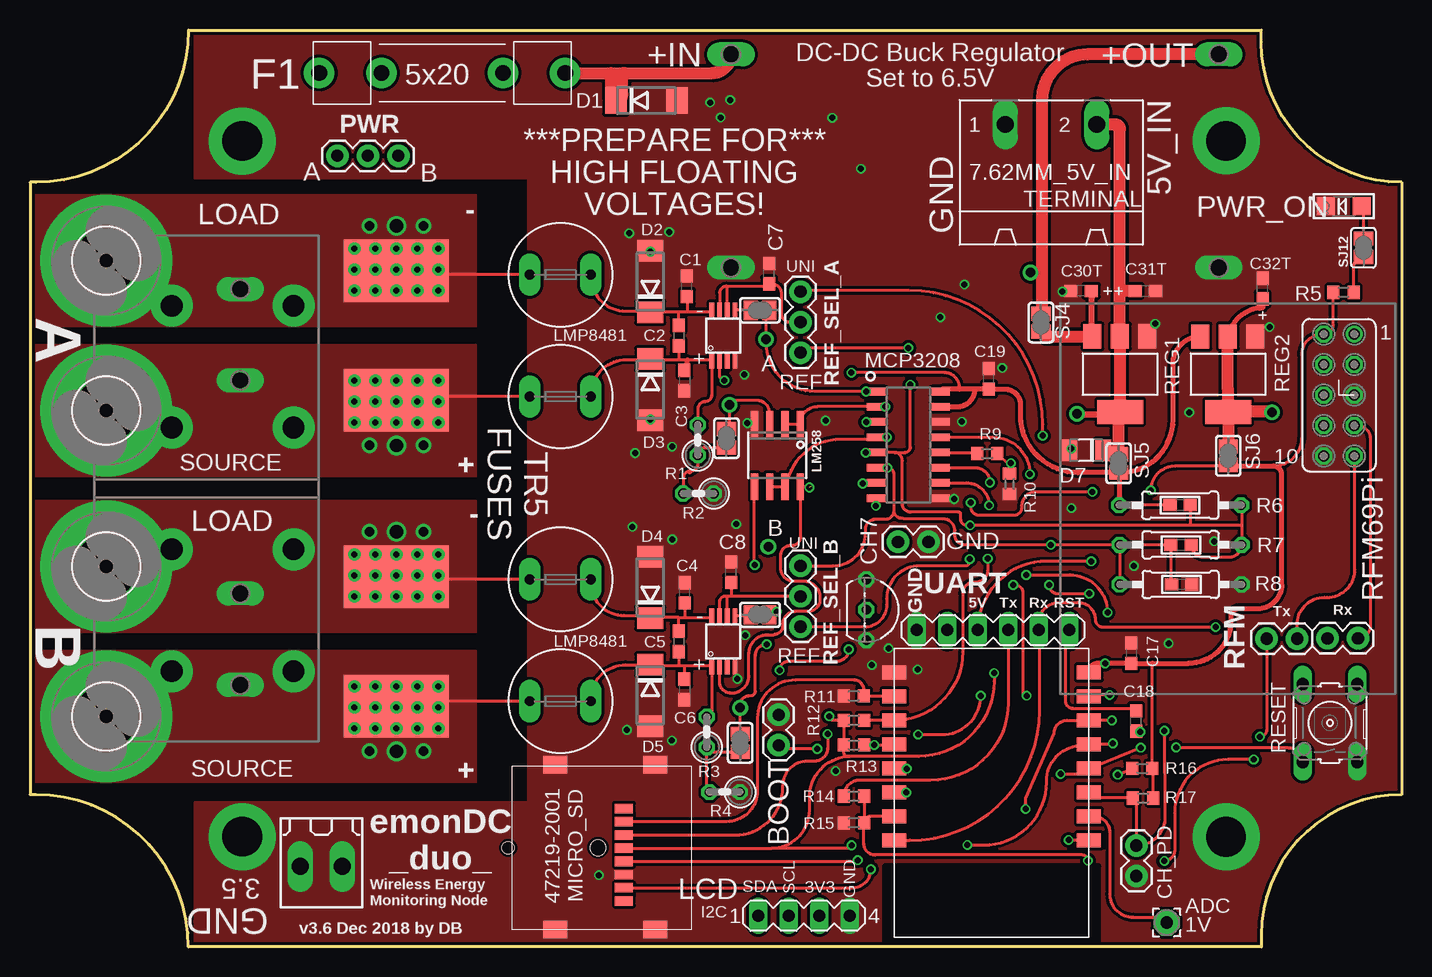
[diagram p1: board, top side]
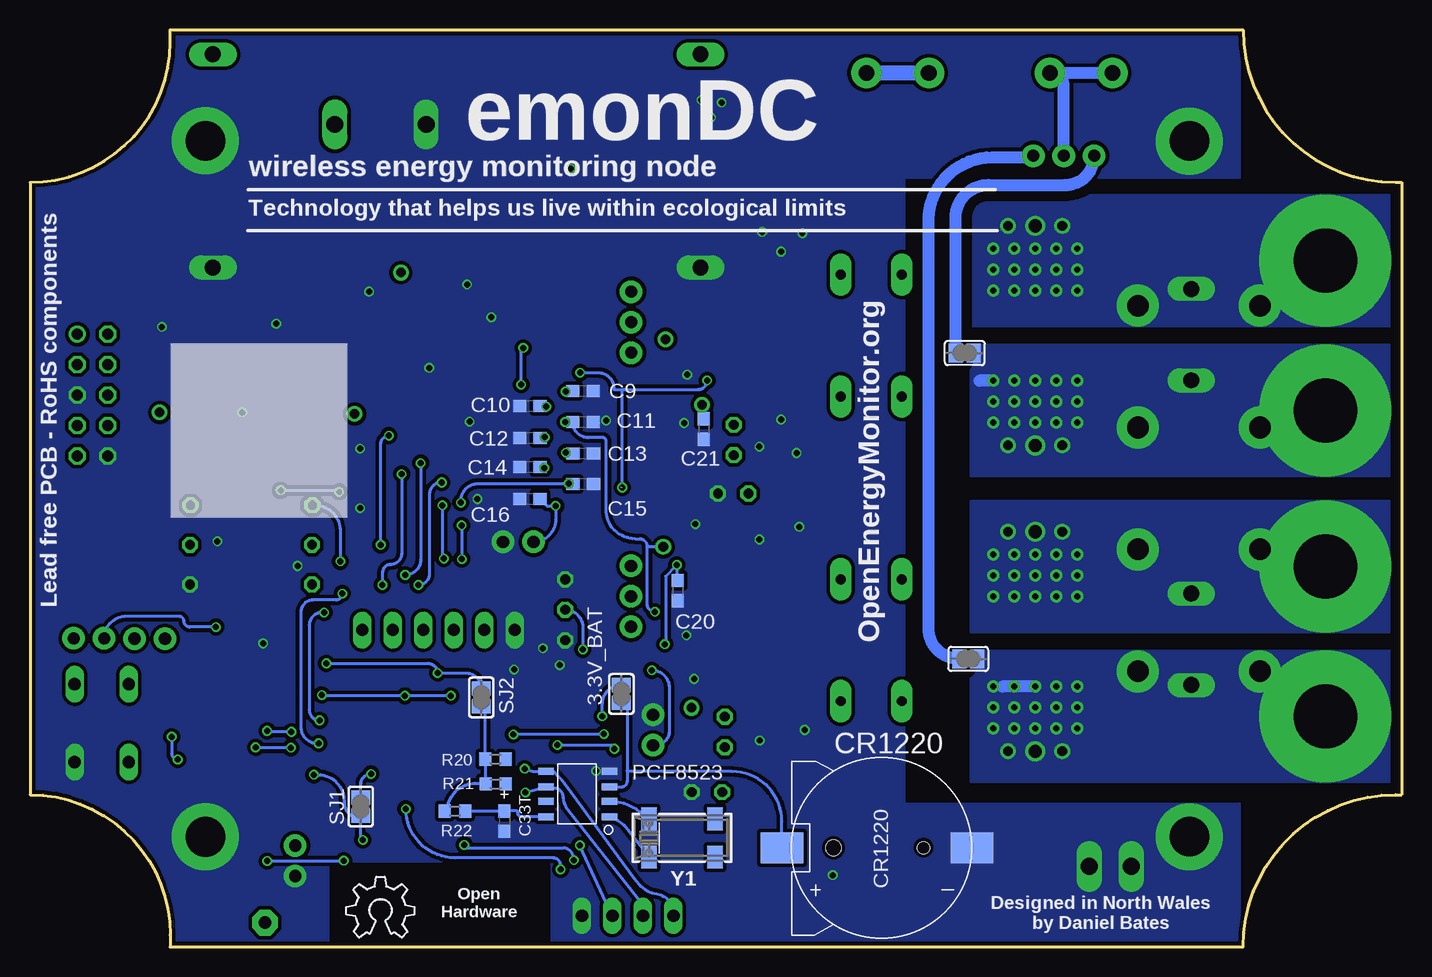
[diagram p2: board, bottom side, seen from below]

Size 114.3 x 76.45 mm. Coordinates in mm from the lower left corner, seen from the top.
Outline: 0,63.75 0,12.7 0.51,12.7 arc-90 13.21,0 102.62,0 102.62,1.02 arc-90 114.3,12.7 114.3,63.75 arc-90 102.62,75.44 102.62,76.45 13.21,76.45 arc-90 0.51,63.75 0,63.75
Copper layers (1*16): Top 0.035mm / dielectric 1.5mm / Bottom 0.035mm
Design rules "dirt_cheap_dirty_boards.v1.1": minimum track width 6mil, minimum drill 12mil, track to track 6mil, track to pad 6mil, pad to pad 6mil, via to via 6mil, smd to smd 0mil, copper to edge 10mil, drill to drill 10mil, minimum pad ring 10mil, minimum via ring 6mil, stop-mask expansion 2mil, vias tented up to drill 25mil, thermal gap 10mil
tRestrict: area 71.2,-0.9 to 89,6.7
bRestrict: area 71.2,-0.9 to 89,6.7

### Footprints (pad centres in the part's own frame; a part is rotated, then mirrored left to right if it is on the bottom)
SOLDERJUMPER_CLOSEDWIRE = smd 1.168 x 1.6: 1 -0.762,0; 2 0.762,0 | smd 0.635 x 0.203: WIRE 0,0
GMSTBA2 = drill 1.397 long: 1 -3.81,5.08; 2 3.81,5.08
2,15/1,0 = drill 1.016 pad 2.159 octagon: 1 0,0
1X02 = drill 1.016 pad 1.88: 1 0,0; 2 2.54,0
C0603 = smd 1.1 x 1: 1 -0.85,0; 2 0.85,0
C0603POL = smd 1.1 x 1: 1 -0.85,0; 2 0.85,0
CR1220SMD = smd 3.54 x 2.6: P+ 8.3,0; P- -7.55,0 | hole 1: -3.5,0 | hole 1.3: 4,0
DO214AA = smd 1.8 x 2.2: A 2.55,0; C -2.55,0
SOD123F = smd 1.34 x 1.8: A 1.43,0; C -1.43,0
EBW_SERIES_15.2MM = smd 5.2 x 8.75: P$1 -5.4,0; P$2 5.4,0 | drill 0.5: P$3 -3.75,3.5; P$4 -3.75,1.75; P$5 -3.75,0; P$6 -3.75,-1.75; P$7 -3.75,-3.5; P$8 -5.5,3.5; P$9 -5.5,1.75; P$10 -5.5,0; P$11 -5.5,-1.75; P$12 -5.5,-3.5; P$13 -7.25,3.5; P$14 -7.25,1.75; P$15 -7.25,0; P$16 -7.25,-1.75; P$17 -7.25,-3.5; P$18 7.25,1.75; P$19 7.25,3.5; P$20 7.25,0; P$21 7.25,-1.75; P$22 7.25,-3.5; P$23 5.5,3.5; P$24 5.5,1.75; P$25 5.5,0; P$26 5.5,-1.75; P$27 5.5,-3.5; P$28 3.75,3.5; P$29 3.75,1.75; P$30 3.75,0; P$31 3.75,-1.75; P$32 3.75,-3.5 | drill 0.8: P$33 -9.155,2.258; P$35 -9.155,-2.258; P$36 9.155,2.258; P$38 9.155,-2.258 | drill 1.1: P$34 -9.155,0; P$37 9.155,0
ESP8266-ESP12 = smd 2 x 1.2: 1 16.2,2; 2 16.2,4; 3 16.2,6; 4 16.2,8; 5 16.2,10; 6 16.2,12; 7 16.2,14; 8 16.2,16; 9 0,16; 10 0,14; 11 0,12; 12 0,10; 13 0,8; 14 0,6; 15 0,4; 16 0,2
445/030_SERIES_LITTELFUSE = drill 1.3 pad 2.54: P$1 -10.25,0; P$2 -5.05,0; P$3 10.25,0; P$4 5.05,0
TR5 = drill 0.813 pad 1.778 long: 1 -2.54,0; 2 2.54,0
FE05-2_RFM69PI_OULTINE = drill 0.914: 1 24.511,29.972 | drill 0.914 octagon: 2 21.971,29.972; 3 24.511,27.432; 4 21.971,27.432; 5 24.511,24.892; 6 21.971,24.892; 7 24.511,22.352; 8 21.971,22.352; 9 24.511,19.812; 10 21.971,19.812
TO92- = drill 0.813 octagon: 1 2.54,0; 2 0,0; 3 -2.54,0
CHIPLED_1206 = smd 1.5 x 1.5: A 0,-1.496; C 0,1.496
SOIC8_150MIL = smd 0.6 x 2.2: 1 -1.905,-2.6; 2 -0.635,-2.6; 3 0.635,-2.6; 4 1.905,-2.6; 5 1.905,2.6; 6 0.635,2.6; 7 -0.635,2.6; 8 -1.905,2.6
SOIC16 = smd 0.635 x 1.524: 1 -4.445,-2.695; 2 -3.175,-2.695; 3 -1.905,-2.695; 4 -0.635,-2.695; 5 0.635,-2.695; 6 1.905,-2.695; 7 3.175,-2.695; 8 4.445,-2.695; 9 4.445,2.695; 10 3.175,2.695; 11 1.905,2.695; 12 0.635,2.695; 13 -0.635,2.695; 14 -1.905,2.695; 15 -3.175,2.695; 16 -4.445,2.695
5,3//11-PAD = drill 5.3 pad 11: B5,5 0,0
47219-2001_MICROSD = smd 1.45 x 2: P$1 0,0; P$2 13.75,0; P$3 0,8.3; P$4 13.75,8.3 | smd 0.8 x 1.5: PIN1 10.08,2.6; PIN2 8.98,2.6; PIN3 7.88,2.6; PIN4 6.78,2.6; PIN5 5.68,2.6; PIN6 4.58,2.6; PIN7 3.48,2.6; PIN8 2.38,2.6
2/10,16 = drill 1.8 pad 3.5: P$1 -5.08,0; P$2 -5.08,10.16; P$3 5.08,0; P$4 5.08,10.16
SOIC_8 = smd 1.3 x 0.6: 1 -2.6,1.9; 2 -2.6,0.6; 3 -2.6,-0.6; 4 -2.6,-1.9; 5 2.7,-1.9; 6 2.7,-0.6; 7 2.7,0.6; 8 2.7,1.9
1X03 = drill 1.016 pad 1.88: 1 0,0; 2 2.54,0; 3 5.08,0
0207/2V = drill 0.813 octagon: 1 -1.27,0; 2 1.27,0
R0603 = smd 1 x 1.1: 1 -0.85,0; 2 0.85,0
0207/10 = drill 0.813 octagon: 1 -5.08,0; 2 5.08,0
0603 = smd 1.1 x 1: 1 -0.85,0; 2 0.85,0
SOT223 = smd 1.499 x 2.007: 1 -2.261,-3.15; 2 0.025,-3.15; 3 2.311,-3.15 | smd 3.81 x 2.007: 4 0,3.15
B3F-10XX = drill 1.016 long: 1 -3.251,2.261; 2 3.251,2.261; 3 -3.251,-2.261; 4 3.251,-2.261
S-PDSO-G08 = smd 0.4 x 1.2: 1 -0.975,-2.157; 2 -0.325,-2.157; 3 0.325,-2.157; 4 0.975,-2.157; 5 0.975,2.157; 6 0.325,2.157; 7 -0.325,2.157; 8 -0.975,2.157
SJ = smd 1.168 x 1.6: 1 -0.762,0; 2 0.762,0
MA04-1 = drill 1.016 long: 1 -3.81,0; 2 -1.27,0; 3 1.27,0; 4 3.81,0
P1-13Y = drill 1.321 pad 1.905 long: TP 0,0
TP0.8 = drill 0.8: P$1 0,0
MA06-1 = drill 1.016 long: 1 0,0; 2 2.54,0; 3 5.08,0; 4 7.62,0; 5 10.16,0; 6 12.7,0
180-2 = drill 1.422 long: 1 -1.75,0; 2 1.75,0
CRYSTAL_8X3.8 = smd 1.3 x 1.9: P$1 -2.75,-1.6; P$2 2.75,-1.6; P$3 2.75,1.6; P$4 -2.75,1.6

### Placement (x,y rotation side)
3.3V_BAT  65.02,21.1 270 bottom
7.62MM_5V_IN  85.09,63.5 0 top
ADC  94.72,2.03 0 top
BOOT  62.39,19.36 270 top
C1  54.75,55.08 90 top
C2  54.05,50.97 270 top
C3  54.53,47.22 270 top
C4  54.56,29.53 90 top
C5  54.05,25.47 270 top
C6  54.53,21.47 270 top
C7  61.59,56.13 90 top
C8  58.42,31.24 90 top
C9  68.21,46.37 0 bottom
C10  72.64,45.09 180 bottom
C11  68.21,43.78 0 bottom
C12  72.64,42.42 180 bottom
C13  68.2,41.15 0 bottom
C14  72.64,40.01 180 bottom
C15  68.2,38.61 0 bottom
C16  72.64,37.34 180 bottom
C17  91.76,24.49 270 top
C18  92.17,18.84 90 top
C19  79.9,47.36 90 top
C20  60.33,29.72 270 bottom
C21  58.17,43.18 270 bottom
C30T  87.59,54.7 180 top
C31T  92.94,54.7 0 top
C32T  102.72,54.89 90 top
C33T  74.77,10.49 270 bottom
CH_PD  92.2,8.45 270 top
CR1220  43.34,8.28 180 bottom
D1  51.37,70.57 0 top
D2  51.69,55.47 90 top
D3  51.69,46.47 270 top
D4  51.69,29.97 90 top
D5  51.69,20.97 270 top
D7  88.01,41.4 180 top
EBW_A  30.54,25.47 90 top
EBW_B  30.54,50.97 90 top
ESP-12  88.23,24.89 180 top
F1  34.35,72.87 0 top
F2  44.2,56.05 0 top
F3  44.2,45.89 0 top
F4  44.2,30.65 0 top
F5  44.2,20.49 0 top
GPIO_1  85.84,21.11 0 top
IC1  69.7,28.11 270 top
J5  72.34,33.77 0 top
LED1  109.49,61.75 90 top
LM258  62.27,40.98 180 top
LOGO1  87.93,0.78 0 bottom
MCP3208  73.21,41.87 270 top
MH1  6.35,44.72 0 top
MH2  6.35,57.22 0 top
MH3  6.35,19.22 0 top
MH4  6.35,31.72 0 top
MICRO_SD  52.09,1.46 90 top
MOUNT_10.16_A  11.81,48.39 270 top
MOUNT_10.16_B  11.81,28.07 270 top
PCF8523  68.61,12.75 180 bottom
PWR  30.7,65.96 180 top
R1  55.65,42.27 90 top
R2  55.7,37.81 180 top
R3  56.4,17.93 90 top
R4  57.89,12.91 180 top
R5  109.46,54.58 180 top
R6  95.85,36.83 180 top
R7  95.88,33.53 0 top
R8  95.88,30.23 180 top
R9  79.77,41.14 0 top
R10  81.63,38.62 270 top
R11  68.64,20.93 180 top
R12  68.65,18.89 180 top
R13  68.65,16.84 180 top
R14  68.66,12.57 0 top
R15  68.65,10.35 180 top
R16  92.68,14.89 0 top
R17  92.76,12.42 0 top
R20  75.51,15.67 0 bottom
R21  75.49,13.59 0 bottom
R22  78.89,11.34 180 bottom
R25  95.85,36.83 180 top
R26  95.92,33.53 0 top
R27  95.97,30.23 180 top
REF_SEL_A  64.21,54.63 270 top
REF_SEL_B  64.21,31.78 270 top
REG1  90.85,47.76 180 top
REG2  99.85,47.75 180 top
RESET  108.33,18.67 90 top
RX  105.59,25.7 180 top
SHUNTMON-A  57.78,50.97 0 top
SHUNTMON-B  57.78,25.47 0 top
SJ1  86.74,11.71 90 bottom
SJ2  76.69,20.8 270 bottom
SJ3  36.41,49.52 0 bottom
SJ4  84.24,52.06 270 top
SJ5  90.72,40.32 270 top
SJ6  99.85,40.95 270 top
SJ7  36.11,24.02 180 bottom
SJ8  58.04,42.42 90 top
SJ9  59.18,17.02 90 top
SJ10  60.83,27.69 0 top
SJ11  60.83,53.09 0 top
SJ12  111.12,58.29 90 top
SV1  64.49,2.6 0 top
TP4  58.42,74.42 90 top
TP5  99.06,74.42 90 top
TP6  99.06,56.64 90 top
TP7  58.42,56.64 90 top
TP8  17.53,21.84 90 top
TP9  17.53,29.46 90 top
TP10  17.53,47.24 90 top
TP11  17.53,54.86 270 top
TX  108.12,25.73 0 top
U$1  58.29,45.21 0 top
U$2  [ALIGNMENT_STOP]  21.14,10.1 0 top
U$3  [ALIGNMENT_STOP]  94.35,67.22 0 top
U$4  59.18,19.94 0 top
U$5  61.53,33.37 0 top
U$6  61.34,50.67 0 top
U$7  87.25,44.45 0 top
U$8  103.5,44.58 0 top
U$9  83.38,56.23 0 bottom
UART  86.61,26.42 180 top
X1_GND  24.28,6.71 180 top
Y1  59.96,9.09 0 bottom

### Tracks (layer width: path | path; a pad name or v marks a point on that pad's centre or on a via)
3.3V_PRE
  Top 0.406: SJ6.1 99.85,44.46 99.99,44.46 REG2.4 99.82,44.63 99.82,45.21 99.82,46.48 REG2.2 99.82,50.92 | C32T.1 102.71,53.28 arc90 99.82,50.39
  Top 0.508: U$8.P$1 103.29,44.58 arc-90 103.24,44.63
  Top 1.016: 103.24,44.63 101.6,44.63 | 101.6,44.63 99.82,44.63 99.82,46.48 99.82,50.39 | REG2.4 SJ6.1 | REG2.4 99.85,45.19 arc90 99.82,45.21 | REG2.4 101.57,44.6 arc90 101.6,44.63
5V_PRE
  Top 0.406: REG1.2 90.88,50.86 | 90.45,44.21 REG1.4 | SJ5.1 90.7,41.1 90.67,42.16 | 90.67,42.16 90.62,44.31 90.17,44.31 87.4,44.31 | D7.C 89.69,41.4 90.01,41.08 90.01,41.37 90.67,42.03 90.67,42.16
  Top 0.508: REG1.2 90.8,50.94 | U$7.P$1 90.03,44.45 arc-90 90.17,44.31 | REG1.4 90.85,44.54 arc-90 90.62,44.31
  Top 1.016: 7.62MM_5V_IN.2 90.42,68.58 | 90.42,68.58 arc-90 90.68,68.33 | SJ5.1 90.72,44.21 arc90 90.62,44.31 | 90.82,54.74 REG1.2 90.82,44.59 90.45,44.21 | 90.82,54.74 90.82,68.18 arc90 90.42,68.58 | C31T.1 90.87,54.7 arc-90 90.82,54.74
6.5V
  Top 0.406: SJ4.2 arc-90 84.64,50.91
  Top 0.508: REG1.3 88.48,50.96 88.48,54.18 arc90 C30T.1
  Top 1.016: 84.64,50.91 REG1.3
+3V3  (via drill 0.5)
  Top 0.254: R17.2 93.61,14.81 arc90 R16.2 93.53,23.64 arc-90 93.54,23.64 | 100.24,40.09 95.42,40.09 arc90 v93.4,38.07 | v88.54,37.95 83.85,37.95 arc90 82.63,36.74 82.63,36.62 arc-90 82,35.98 79.09,35.98 arc-90 78.42,36.66 78.42,37.02 arc90 v78.39,37.05 | v69.4,38.64 70.46,38.64 MCP3208.7 | v80.33,22.84 80.33,22.16 arc-90 74.07,15.89 68.34,15.89 | MICRO_SD.PIN4 61.79,8.24 | 61.79,8.24 arc90 64.96,11.41 64.96,12.51 arc-90 68.34,15.89 | 107.85,51.12 arc-90 GPIO_1.2 | GPIO_1.2 107.68,51.09 arc90 105.96,49.37 105.96,42.43 arc-90 103.62,40.09 | v68.47,8.47 arc-90 68.24,8.24 61.79,8.24 | v66.61,19.24 arc90 66.95,18.89 R12.2 R13.2 arc90 67.82,16.82 67.82,16.18 arc90 68.11,15.89 68.34,15.89 | GPIO_1.2 arc90 108.6,51.88 R5.2
  Top 0.406: SJ6.2 arc90 99.95,40.09 100.24,40.09 103.62,40.09 arc-90 104.31,39.39 104.31,30.21 arc-90 102.3,28.19 100.71,28.19 arc90 100.08,27.56 100.08,27.18 arc-90 96.54,23.64 93.54,23.64 C17.2 v89.59,23.64 88.99,23.64 arc90 ESP-12.16
  Bottom 0.254: v93.4,38.07 88.65,38.07 arc90 v88.54,37.95 | v78.39,37.05 78.39,37.19 arc90 76.94,38.64 v69.4,38.64 | v69.4,38.64 69.08,38.64 | 69.37,38.61 arc90 v69.4,38.64 | v89.59,23.64 81.14,23.64 arc90 v80.33,22.84 77.96,22.84 arc90 SJ2.1 | v66.61,19.24 66.61,20.27 arc90 3.3V_BAT.1 | C15.1 v69.4,38.64 | SV1.3 v68.47,8.47
+5V  (via drill 0.5)  (1 unrouted)
  Top 0.254: 65.11,38.38 LM258.8 64.18,34.16 arc-90 63.48,33.46 63.38,33.46 arc90 62.54,32.61 62.54,31.59 arc90 63.61,30.51 64.46,30.51 arc-90 65.83,29.14 65.83,28.98 arc-90 64.81,27.96 63.77,27.96 arc90 62.72,26.91 62.72,26.77 arc-90 62,26.05 arc-90 61.99,26.04 61.48,26.04 arc90 59.91,24.47 59.91,22.64 arc-90 58.44,21.17 58.38,21.17 arc-90 57.48,22.07 57.48,23.3 arc90 SHUNTMON-B.2 | 77.47,46.61 arc90 76.2,47.88 v68.45,47.88 | SHUNTMON-A.2 57.45,47.66 arc90 v57.87,47.24 | v88.44,32.15 84.71,32.15 arc90 UART.4 | R25.2 R6.2
  Top 0.406: SJ5.2 90.86,39.55 arc90 95.25,43.94 95.25,48.62 arc-90 REG2.3 | SJ5.2 arc-90 90.77,39.51 R6.2 | SJ5.2 87.32,39.55 arc-90 82.55,44.32 82.55,45.21 arc90 81.28,46.48 79.93,46.48 arc-90 C19.1 78.74,46.51 | 78.74,46.51 77.47,46.51 | 77.47,46.51 76.1,46.51 arc90 MCP3208.16 | MCP3208.15 77.27,45.04 arc90 78.74,46.51 | 77.47,46.51 77.47,46.61
  Bottom 0.254: v68.45,47.88 66.93,47.88 arc90 65.66,46.61 65.66,46.48 64.77,46.48 | 64.77,46.48 58.63,46.48 arc-90 v57.87,47.24 | R6.2 90.6,36.83 arc90 88.44,34.66 v88.44,32.15 | v64.95,38.31 64.95,46.3 arc90 64.77,46.48
ADC
  Top 0.254: ESP-12.10 88.65,10.89 arc-90 89.97,9.57 89.97,4.42 arc90 91.91,2.48 94.27,2.48 arc-90 ADC.1
ADCSHUNT_A  (via drill 0.5)
  Top 0.254: 61.36,50.33 arc90 65.38,46.31 v69.67,46.31 MCP3208.1 | 61.36,50.33 61.36,52.85 arc-90 SJ11.2 | U$6.P$1 61.34,50.35 arc90 61.36,50.33
  Bottom 0.254: v69.67,46.31 69.12,46.31 arc-90 C9.1
ADCSHUNT_B  (via drill 0.5)
  Top 0.254: MCP3208.3 v69.69,43.77 | v62.23,27.94 61.85,27.94 arc90 SJ10.2
  Bottom 0.254: v62.23,27.94 arc90 62.87,28.58 62.87,33.4 | 62.87,33.4 arc-90 63.5,34.04 63.88,34.04 arc90 66.29,36.45 66.29,42.2 arc-90 66.56,42.47 67.76,42.47 arc90 C11.1 | v69.69,43.77 C11.1 | C11.1 arc-90 C11.1 | U$5.P$1 62.83,33.37 arc90 62.87,33.4
BI_REF  (via drill 0.5)
  Top 0.254: 100.96,36.79 100.96,35.16 | 100.96,35.16 R7.2 arc-90 99.95,32.51 97.79,32.51 arc-90 R26.2 | 100.96,35.16 96.52,35.16 | 96.52,35.16 v78.34,35.16 78.05,35.16 arc-90 77.56,35.65 77.56,36.08 arc90 77.38,36.26 73.37,36.26 arc-90 72.69,36.94 72.69,40.55 arc90 72.01,41.23 | v73.2,49.94 64.6,49.94 arc90 REF_SEL_A.3 | 72.01,41.23 72.89,41.23 arc90 73.37,41.72 v73.37,46.87 | v78.31,32.33 78.31,32.11 arc-90 77.97,31.77 74.12,31.77 arc90 71.39,29.04 71.39,28.52 arc-90 69.53,26.67 64.24,26.67 arc-90 REF_SEL_B.3 | R25.1 96.7,35.33 arc-90 96.52,35.16 | v69.65,41.21 arc-90 69.67,41.23 MCP3208.5 72.01,41.23
  Top 0.406: R6.1 arc-90 100.96,36.79
  Bottom 0.254: v73.37,46.87 73.37,49.77 arc90 v73.2,49.94 | v78.34,35.16 78.34,32.36 arc-90 v78.31,32.33 | v69.65,41.21 69.11,41.21 arc90 C13.1
CH7  (via drill 0.5)
  Top 0.254: MCP3208.8 70.51,36.79 arc-90 v70.5,36.78
  Bottom 0.254: C16.1 71.23,36.78 v70.5,36.78 70.5,35.61 arc90 J5.1
CH_PD  (via drill 0.5)
  Top 0.254: ESP-12.11 arc90 88.71,12.42 R17.1 92.2,12.13 92.2,8.9 | 92.2,8.9 | 92.2,8.9 CH_PD.1 arc90 94.58,10.84 v94.54,18.02 | C18.1 92.46,17.99 arc-90 v92.52,17.93
  Bottom 0.254: v92.52,17.93 94.44,17.93 v94.53,18.02 v94.54,18.02
D0/RX
  Top 0.254: GPIO_1.7 110.64,43.47 arc-90 111.69,42.41 111.69,26.76 arc-90 TX.2
D1/TX
  Top 0.254: RX.1 105.59,26.87 arc-90 107.87,29.15 108.1,29.15 arc90 110.42,31.47 110.42,40.86 arc90 GPIO_1.9
ESPRX  (via drill 0.5)
  Top 0.254: R14.2 R15.1 | R15.1 arc-90 R15.1 | ESP-12.7 70.04,10.89 arc90 R15.1 | R15.1 arc90 69.49,10.34 69.49,8.62 arc90 70.44,7.66 87.69,7.66 arc-90 v88.16,7.2 | v102.49,17.53 arc90 103.05,18.09 RX.2 | v101.98,15.62 99.82,15.62 arc90 95.38,11.18 95.38,8.01 arc-90 v94.53,7.16 arc90 94.45,7.24
  Bottom 0.254: v102.49,17.53 102.49,16.13 arc-90 v101.98,15.62 | 94.5,7.19 v94.53,7.16 94.51,7.18 88.18,7.18 arc-90 v88.16,7.2
ESPTX  (via drill 0.5)
  Top 0.254: ESP-12.8 73.33,8.89 arc90 84.13,19.7 84.13,26.36 arc90 UART.2 84.07,27.01 arc-90 85.78,28.73 87.35,28.73 arc-90 88.77,27.3 arc90 89.41,26.67 v98.8,26.66
  Bottom 0.254: v98.8,26.66 100.96,26.67 arc90 101.47,27.18 arc-90 101.85,27.56 106.3,27.56 arc-90 TX.1
GND  (via drill 0.5, 3.3 pad 5.59)
  other vias: 17.69,67.2 99.68,67.22 17.69,9.19 99.68,9.19 59.53,47.71 58.96,22.35 51.71,57.98 51.71,43.98 53.49,17.21 49.93,59.51 53.51,41.71 50.42,41.18 49.74,18.1 53.52,33.98 50.19,35.03 58.35,70.62 56.67,70.41 57.55,69.15 86.04,54.65 96.61,44.57 59.79,43.69 81.03,48.27 53.27,59.62 77.01,37.35 77.66,43.79 94.88,25.31 67.13,14.66 86.79,41.54 86.79,36.59 103.3,51.7 93.78,51.96 70.15,23.51 71.55,24.91 73.96,23.13 47.4,5.98 59.6,25.99 58.85,35.25 98.69,33.82 92,31.76 75.86,52.5 77.87,55.24 66.85,69.13 69.24,64.88 66.3,43.9
  pour Bottom (isolate 0.305, rank 3, no thermals): 13.46,76.2 13.46,64.11 41.41,64.11 41.41,11.96 13.46,11.96 13.46,0.25 102.36,0.25 113.91,12.95 113.91,63.5 102.36,76.2
  pour Top (isolate 0.254, rank 3, no thermals): 13.72,76.33 13.72,64.13 41.53,64.13 41.53,12.01 13.72,12.01 13.72,0.25 102.36,0.25 113.91,12.95 113.91,63.5 102.36,76.2
GPIO0  (via drill 0.5)
  Top 0.254: ESP-12.4 arc-90 71.98,16.84 v70.35,16.84 R13.1 | v65.6,16.51 62.7,16.51 arc-90 BOOT.2 | v68.23,24.81 arc-90 67.22,23.81 63.21,23.81 arc90 v62.47,23.07
  Bottom 0.254: v70.35,16.84 65.93,16.84 arc90 v65.6,16.51 | IC1.2 arc90 68.23,26.64 v68.23,24.81 | v62.47,23.07 arc90 61.03,21.63 61.03,17.99 arc90 62.2,16.82 BOOT.2
GPIO2  (via drill 0.5)
  Top 0.254: R12.1 arc90 R12.1 ESP-12.3 arc90 77.73,24.58 77.73,29.48 arc-90 78.63,30.38 78.74,30.38 arc90 79.81,31.45 v79.81,32.38 | MCP3208.10 78.05,38.69 arc-90 v79.93,36.82
  Bottom 0.254: v79.93,36.82 79.93,32.5 arc-90 v79.81,32.38
GPIO12  (via drill 0.5)
  Top 0.254: R9.2 81.63,40.13 R10.1 81.63,40.22 arc-90 v81.74,40.34 | v83.03,31.02 86.65,31.02 arc-90 v89.79,27.87 | v90.16,18.89 ESP-12.14 arc90 ESP-12.14 86.41,18.89 arc90 85.35,17.83 82.97,12.39 v82.97,11.51 | MICRO_SD.PIN7 68.55,4.94 arc90 v70.08,6.47
  Bottom 0.254: v81.74,40.34 81.74,32.3 arc90 v83.03,31.02 | v90.16,18.89 arc90 91.03,19.76 91.03,26.83 arc90 89.99,27.87 v89.79,27.87 | v70.08,6.47 70.08,6.79 arc-90 70.72,7.43 78.89,7.43 arc90 v82.97,11.51
GPIO12A
  Top 0.254: R9.1 78.83,41.23 MCP3208.12
GPIO13  (via drill 0.5)
  Top 0.254: MCP3208.11 78.76,39.96 arc-90 v79.99,38.73 | v81.93,30.18 82.1,30.18 arc-90 82.74,29.54 82.74,21.25 arc90 v83.05,20.94 | v89.97,21 88.34,21 arc90 ESP-12.15 | MICRO_SD.PIN3 58.79,9.34 arc90 62.73,13.28 62.73,13.46 arc-90 64.75,15.48 65.35,15.48 arc90 66.47,16.6 v66.47,17.75 | v74.01,17.71 75.99,17.71 arc90 v79.23,20.94
  Bottom 0.254: v79.99,38.73 80.02,38.73 arc-90 81.02,37.73 81.02,31.09 arc90 v81.93,30.18 | v89.97,21 arc-90 89.91,20.94 v83.05,20.94 v79.23,20.94 | v74.01,17.71 73.96,17.75 v66.47,17.75
GPIO14  (via drill 0.5)
  Top 0.254: MCP3208.13 80.25,42.5 arc-90 v83.33,39.42 | v84.93,30.18 arc90 85.65,29.46 v88.27,29.46 | v90.25,16.98 arc-90 90.16,16.89 ESP-12.13 arc-90 88.14,16.8 87.68,16.8 arc90 84.71,13.83 84.71,13.73 arc-90 79.48,8.5 v78.11,8.5 | MICRO_SD.PIN5 68.71,7.14 arc90 v68.98,7.24
  Bottom 0.254: v83.33,39.42 83.33,32.81 arc90 84.25,31.88 arc-90 84.93,31.21 v84.93,30.18 | v88.27,29.46 arc90 88.8,28.93 90.72,28.93 arc-90 91.73,27.92 91.73,18.36 arc-90 90.35,16.98 v90.25,16.98 | v78.11,8.5 arc-90 77.88,8.26 69.82,8.26 arc90 v68.98,7.24
GPIO15
  Top 0.254: ESP-12.2 69.53,20.89 arc90 R11.1 69.5,21.44 arc90 68.68,22.26 63.77,22.26 arc90 60.62,19.1 60.62,13.01 arc-90 58.05,10.45 MICRO_SD.PIN2 arc90 MICRO_SD.PIN2
GPIO16  (via drill 0.5)
  Top 0.254: v85.88,14.42 87.77,14.42 arc90 ESP-12.12 arc-143 88.9,15.11 v92.56,16.62 | RESET.1 arc90 104.87,16.62 arc90 104.85,16.64 v95.5,16.64
  Bottom 0.254: SJ1.2 86.74,13.57 arc90 v85.88,14.42 | v92.56,16.62 95.48,16.62 arc90 v95.5,16.64
LOAD-NEG-A
  Top 0.254: F2.1 30.86,56.05
  Top 0.61: 30.86,56.05 EBW_B.P$2
  pour Top (no thermals): 0.35,62.72 37.16,62.72 37.16,51.72 0.35,51.72
  pour Bottom (isolate 0.813, no thermals): 35.89,62.72 0.35,62.72 0.35,51.72 35.89,51.72
LOAD-NEG-A_T
  Top 0.254: 54.05,52.97 51.69,52.97 D2.C | 54.05,52.97 54.78,52.97 | 54.78,52.97 56.8,52.97 | C2.1 54.05,52.97 | 54.78,52.97 54.78,53.87 arc-90 54.75,53.91 C1.1 | 46.74,55.91 arc90 49.63,53.02 51.64,53.02
  Top 0.406: 56.8,52.97 SHUNTMON-A.8 | F2.2 46.74,55.91 | 51.64,53.02 arc-90 51.69,52.97
LOAD-NEG-B
  Top 0.254: F4.1 32.1,30.65
  Top 0.61: 32.1,30.65 EBW_A.P$26
  pour Top (no thermals): 0.35,37.22 37.16,37.22 37.16,26.22 0.35,26.22
  pour Bottom (isolate 0.813, no thermals): 35.89,37.22 0.35,37.22 0.35,26.22 35.89,26.22
LOAD-NEG-B_T
  Top 0.254: 54.05,27.47 54.59,27.47 | 54.59,27.47 56.8,27.47 | C5.1 54.05,27.47 | 54.05,27.47 51.73,27.47 | C4.1 54.56,27.5 arc90 54.59,27.47 | 46.74,30.39 arc90 49.49,27.64 51.55,27.64
  Top 0.406: 56.8,27.47 SHUNTMON-B.8 | 51.01,27.64 51.19,27.47 51.73,27.47 arc90 51.55,27.64 | F4.2 46.74,30.39
  Top 0.61: 51.01,27.64 51.24,27.42 D4.C
N$1
  Top 0.508: U$9.P$1 84.13,56.23 arc90 84.33,56.42
  Top 1.016: TP5.TP 88.14,74.42 arc90 84.33,70.61 84.33,56.42 84.33,52.91 arc-90 SJ4.1 arc-90 SJ4.1
N$3
  Bottom 1.016: SJ3.1 37.17,60.79 arc90 34.44,63.52 28.05,63.52 arc-90 PWR.3
N$4
  Bottom 1.016: SJ7.2 arc90 39.42,26.57 39.42,60.53 arc90 34.12,65.84 30.82,65.84 arc-90 PWR.1
N$5
  Top 0.254: R5.1 110.3,56.71 arc-90 SJ12.1
N$6
  Top 0.254: SJ12.2 111.12,61.62 LED1.A
N$10
  Top 0.254: SHUNTMON-B.5 60.01,27.63 arc90 SJ10.1
N$11
  Top 0.254: SJ11.1 58.8,53.09 arc-90 SHUNTMON-A.5
N$36
  Top 0.254: R14.1 arc-90 69.14,13.9 75.06,13.9 arc90 81.53,20.36 UART.3
N$44
  Bottom 0.254: Y1.P$4 62.84,10.69 arc-46 PCF8523.2
N$45
  Bottom 0.254: Y1.P$1 64.47,9.76 arc-34 PCF8523.1
REF_A_INPUT
  Top 0.254: REF_SEL_A.2 63.33,52.09 arc-90 62.61,52.8 62.61,54.48 arc90 61.81,55.28 C7.1 arc-90 61.39,55.08 58.03,55.08 | 58.03,55.08 arc90 57.47,54.52 57.47,53.14 arc-90 SHUNTMON-A.7 | SHUNTMON-A.6 58.11,55.01 arc90 58.03,55.08
REF_B_INPUT
  Top 0.254: REF_SEL_B.2 58.39,29.24 | 58.39,29.24 58.12,29.24 | 58.12,29.24 57.93,29.24 arc90 57.45,28.76 SHUNTMON-B.7 arc90 SHUNTMON-B.7 | SHUNTMON-B.6 58.11,29.22 arc-90 58.12,29.24 | C8.1 58.42,29.27 arc-90 58.39,29.24
RESET
  Top 0.254: C18.2 arc90 91.98,19.87 86.92,19.87 arc-90 86.31,20.49 86.31,26.12 arc-90 UART.1
RST  (via drill 0.5)
  Top 0.254: ESP-12.9 86.58,8.89 arc-90 v86.55,8.92 | v90.65,14.37 R16.1
  Bottom 0.254: 86.77,10.7 86.77,10.92 SJ1.1 | 86.77,10.7 86.77,9.13 v86.55,8.92 | v90.65,14.37 90.3,14.37 arc90 88.13,12.19 88.13,12.07 arc-90 86.77,10.7
SCL  (via drill 0.5)
  Top 0.254: ESP-12.6 v73.02,12.88
  Bottom 0.254: v73.02,12.88 PCF8523.6 arc-49 70.72,13.22 arc104 69.87,12.51 arc-36 69.63,11.69 63.43,3.83 SV1.2
SDA  (via drill 0.5)
  Top 0.254: ESP-12.5 v73.07,14.87
  Bottom 0.254: v73.07,14.87 72.41,14.65 PCF8523.5 arc69 70.58,14.54 arc10 69.67,13.53 63.96,5.71 63.55,5.23 arc-40 62.05,4.41 arc88 SV1.1
SOURCE-POS-A
  Top 0.254: F3.1 29.89,45.89
  Top 0.61: 29.89,45.89 29.84,45.85
  Bottom 1.016: EBW_B.P$7 35.18,47.22
  pour Top (no thermals): 0.35,50.22 37.16,50.22 37.16,39.22 0.35,39.22
  pour Bottom (isolate 0.813, no thermals): 35.89,50.22 0.35,50.22 0.35,39.22 35.89,39.22
SOURCE-POS-A_T
  Top 0.254: 51.69,48.97 54.05,48.97 | 54.05,48.97 54.78,48.97 56.8,48.97 | C2.2 54.05,48.97 | 46.74,46 arc-90 49.7,48.97 51.68,48.97 | SHUNTMON-A.1 56.8,46.01 arc-90 56.26,45.47 arc90 55.65,44.86 R1.2
  Top 0.305: D3.C 51.69,48.97
  Top 0.406: C3.1 54.78,48.07 54.78,48.97 | 56.8,48.68 SHUNTMON-A.1 56.8,48.97 | F3.2 46.74,46 | 51.68,48.97 arc90 51.69,48.97
SOURCE-POS-B
  Top 0.254: F5.1 31.8,20.49
  Top 0.61: 31.8,20.49 31.75,20.45
  Bottom 1.016: EBW_A.P$5 33.28,21.72
  pour Top (no thermals): 0.35,24.72 37.16,24.72 37.16,13.72 0.35,13.72
  pour Bottom (isolate 0.813, no thermals): 35.89,24.72 0.35,24.72 0.35,13.72 35.89,13.72
SOURCE-POS-B_T
  Top 0.254: 51.69,23.47 54.05,23.47 | 54.53,23.47 56.8,23.47 | C5.2 54.05,23.47 | 54.05,23.47 54.53,23.47 | 54.53,23.47 C6.1 | SHUNTMON-B.1 56.8,19.81 | 56.8,19.81 56.8,19.58 | 46.74,20.63 arc-90 49.63,23.52 51.63,23.52 | R3.2 arc90 56.8,19.6 56.8,19.81
  Top 0.305: D5.C 51.69,23.47
  Top 0.406: 56.8,23.47 SHUNTMON-B.1 | F5.2 46.74,20.63 | 51.63,23.52 arc-90 51.69,23.47
UNI_REF  (via drill 0.5)
  Top 0.254: R7.1 v85.07,33.53 77.91,33.52 arc-90 77.07,34.37 77.07,34.69 arc90 76.06,35.7 72.81,35.7 arc-90 72.77,35.73 72.65,35.73 arc-90 72.01,36.38 | 72.01,36.38 72.01,39.39 arc90 v71.45,39.95 70.52,39.95 MCP3208.6 | REF_SEL_A.1 arc-90 64.31,54.73 73.25,54.73 arc-90 84.4,43.59 v84.4,42.63 | REF_SEL_B.1 66.94,31.78 arc90 69.63,34.47 69.63,34.81 arc-90 70.5,35.68 71.3,35.68 arc90 72.01,36.38 | R7.1 R8.2 | R27.2 95.12,33.48 arc90 R26.1 R7.1
  Bottom 0.254: v85.07,33.53 85.07,41.95 arc90 v84.4,42.63 | v71.45,39.95 arc-90 71.51,40.01 C14.1
V_IN_POSTFUSE
  Top 1.016: F1.P$3 48.43,72.87 | 48.43,72.87 49.53,72.87 | 49.53,72.87 56.87,72.87 arc90 TP4.TP | D1.C 48.82,72.16 arc-90 49.53,72.87 | D1.C arc-90 48.43,70.96 48.43,72.87 | D1.C arc90 49.36,71.11 49.36,72.82
  Bottom 1.27: F1.P$4 F1.P$3
V_IN_PREFUSE
  Bottom 1.016: F1.P$1 F1.P$2 arc90 28.16,71.72 PWR.2
VBAT
  Bottom 0.254: 3.3V_BAT.2 65.02,20.01 64.54,20.01 64.54,14.69 | 64.54,14.69 64.54,13.82 arc90 65.04,13.32 65.98,13.32 arc90 PCF8523.3 | CR1220.P+ 51.64,10.46 arc-90 55.82,14.63 64.49,14.63 arc90 64.54,14.69
VDD_PCF
  Bottom 0.254: PCF8523.8 73.35,10.85 arc90 73.64,11.14 73.64,11.19 arc-90 73.8,11.36 74.49,11.36 | 74.49,11.36 74.74,11.36 arc-90 C33T.1 | R22.1 74.51,11.34 arc-90 74.49,11.36
VDD_RTC_POSTJUMPER
  Bottom 0.254: R22.2 79.52,11.34 arc90 77.21,13.65 76.4,13.65 arc-90 R21.1 76.34,15.65 arc-90 R20.1 76.36,19.71 arc-90 SJ2.2
VSENSE_A
  Top 0.254: 57.68,41.3 arc90 SJ8.1 56.3,41.66 arc90 R1.1 55.65,40.3 arc-90 54.99,39.64 | 54.94,39.64 arc90 54.46,39.16 54.46,37.83
  Top 0.406: 54.99,39.64 54.94,39.64 | 54.46,37.83 arc-90 R2.2
VSENSE_A_BUFFED  (via drill 0.5)
  Top 0.254: LM258.2 LM258.1 arc-90 65.64,45.04 MCP3208.2 v71.27,45.04 arc-90 v71.27,45.04
  Bottom 0.254: v71.27,45.04 71.75,45.04 arc90 C10.1
VSENSE_A_TP
  Top 0.254: LM258.3 arc-90 61.59,43.63 61.59,44.58 arc90 60.58,45.59 58.67,45.59 arc90 U$1.P$1 58.29,43.43 arc-90 SJ8.2
  Bottom 0.254: U$1.P$1 58.29,44.16 C21.1
VSENSE_B
  Top 0.254: SJ9.1 56.8,16.26 arc-90 R3.1 56.4,13.13 arc90 R4.2
VSENSE_B_BUFFED  (via drill 0.5)
  Top 0.254: LM258.6 LM258.7 | 62.93,38.37 arc90 LM258.7 | v71.41,42.51 MCP3208.4 arc90 MCP3208.4 70.33,42.32 67.53,42.32 arc90 62.94,37.73 62.94,38.35 LM258.7
  Bottom 0.254: C12.1 71.5,42.42 arc-90 v71.41,42.51
VSENSE_B_TP  (via drill 0.5)
  Top 0.254: SJ9.2 U$4.P$1 59.18,20.19 arc-90 59.94,20.96 60.07,20.96 arc90 60.45,21.34 60.45,24.3 arc-90 v61.4,25.25 | LM258.5 arc90 60.33,38.34 60.33,31.88 60.37,31.88 v60.4,31.85
  Bottom 0.254: v61.4,25.25 61.34,25.3 61.34,30.91 v60.4,31.85 60.4,30.64 arc90 C20.1

### Text on the board
bPlace: emonDC | wireless energy monitoring node | Technology that helps us live within ecological limits | Lead free PCB - RoHS components | OpenEnergyMonitor.org | Open / Hardware | Designed in North Wales / by Daniel Bates
tNames: +IN | +OUT | DC-DC Buck Regulator / Set to 6.5V | 5x20 | 5V_IN | A | B | ***PREPARE FOR*** / HIGH FLOATING / VOLTAGES! | GND | LOAD | - | TERMINAL | PWR_ON | LMP8481 | A | SOURCE | + | TR5 / FUSES | LOAD | - | CH7 | GND | LMP8481 | RFM | B | + | SOURCE | LCD | SCL | 3.5 | SDA | 3V3 | GND | GND | I2C | 1V
tSilk: UNI | A | REF | RFM69Pi | B | UNI | GND | 5V | Tx | Rx | RST | Tx | Rx | REF | emonDC / _duo_ | Wireless Energy / Monitoring Node | v3.6 Dec 2018 by DB
_tsilk: Designed in | North Wales | Made in UK
_bsilk: SMT V0.6 rev3 | emonTx | wireless energy monitoring node | SMT V0.6 rev3 | emonTx | SMT V0.6 rev3 | emonTx | Technology that helps us live within ecological limits | wireless energy monitoring node | wireless energy monitoring node | Designed in North Wales UK by Glyn Hudson & Trystan Lea | Technology that helps us live within ecological limits | Technology that helps us live within ecological limits | Designed in North Wales UK by Glyn Hudson & Trystan Lea | 165mm ant | 433Mhz | Designed in North Wales UK by Glyn Hudson & Trystan Lea | 165mm ant | 165mm ant | 433Mhz | 433Mhz | 868Mhz | 82mm ant | 82mm ant | 82mm ant | 868Mhz | 868Mhz | 78mm ant | 915Mhz | 78mm ant | 915Mhz | 78mm ant | 915Mhz | 165mm ant | 433Mhz | 82mm ant | 868Mhz | 78mm ant | 915Mhz